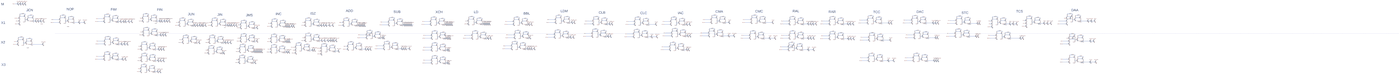
[diagram p0: schematic micro_instructions.asc, whole sheet]
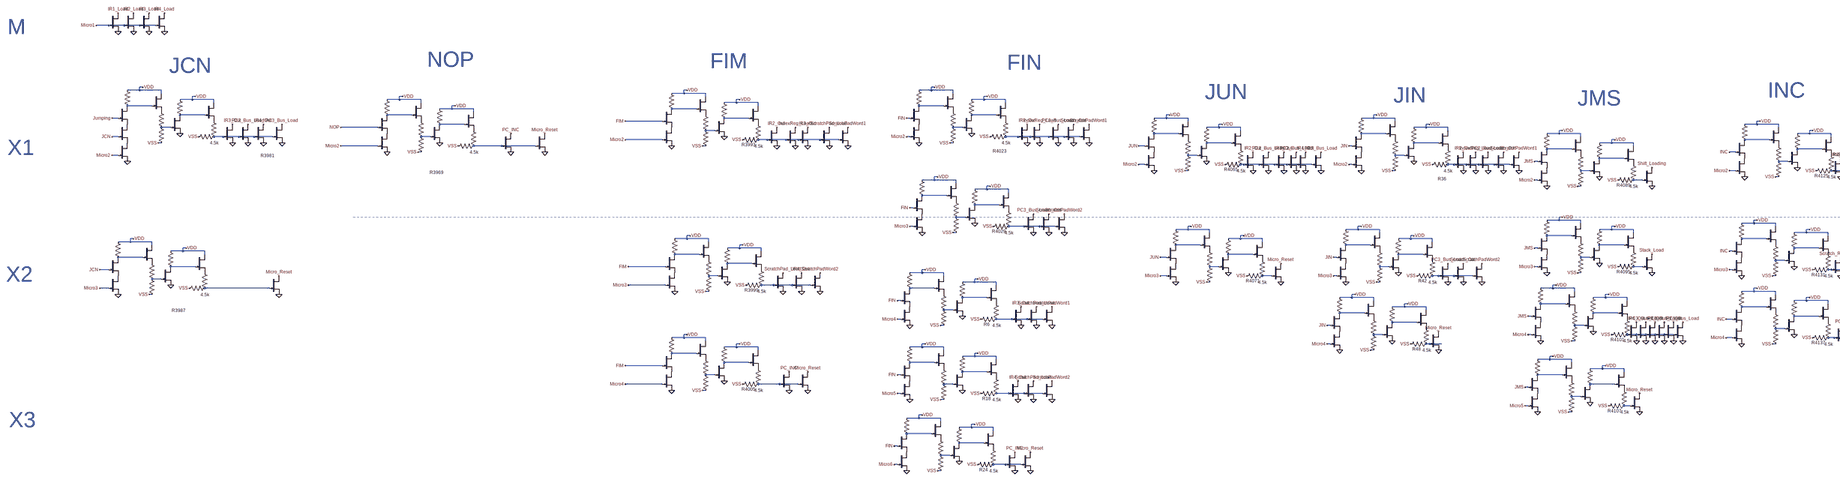
[diagram p1: schematic micro_instructions.asc, part, row 1 of 1, column 1 of 5]
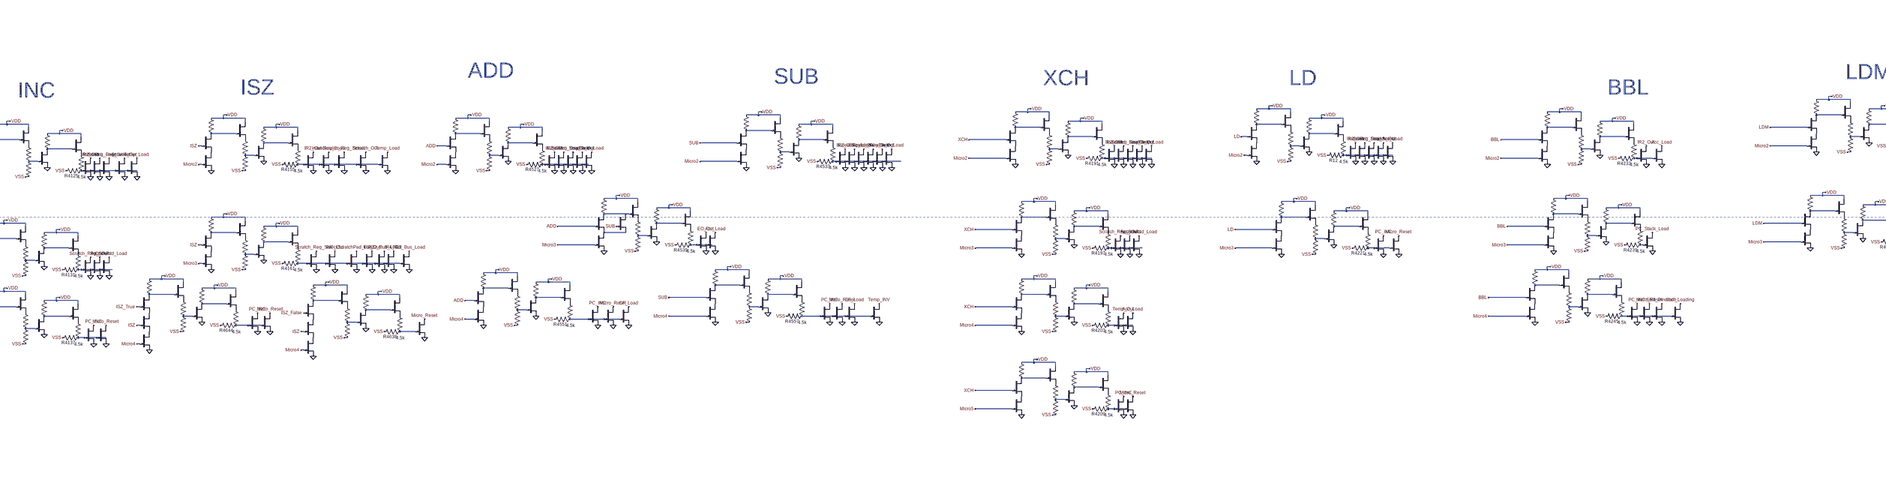
[diagram p2: schematic micro_instructions.asc, part, row 1 of 1, column 2 of 5]
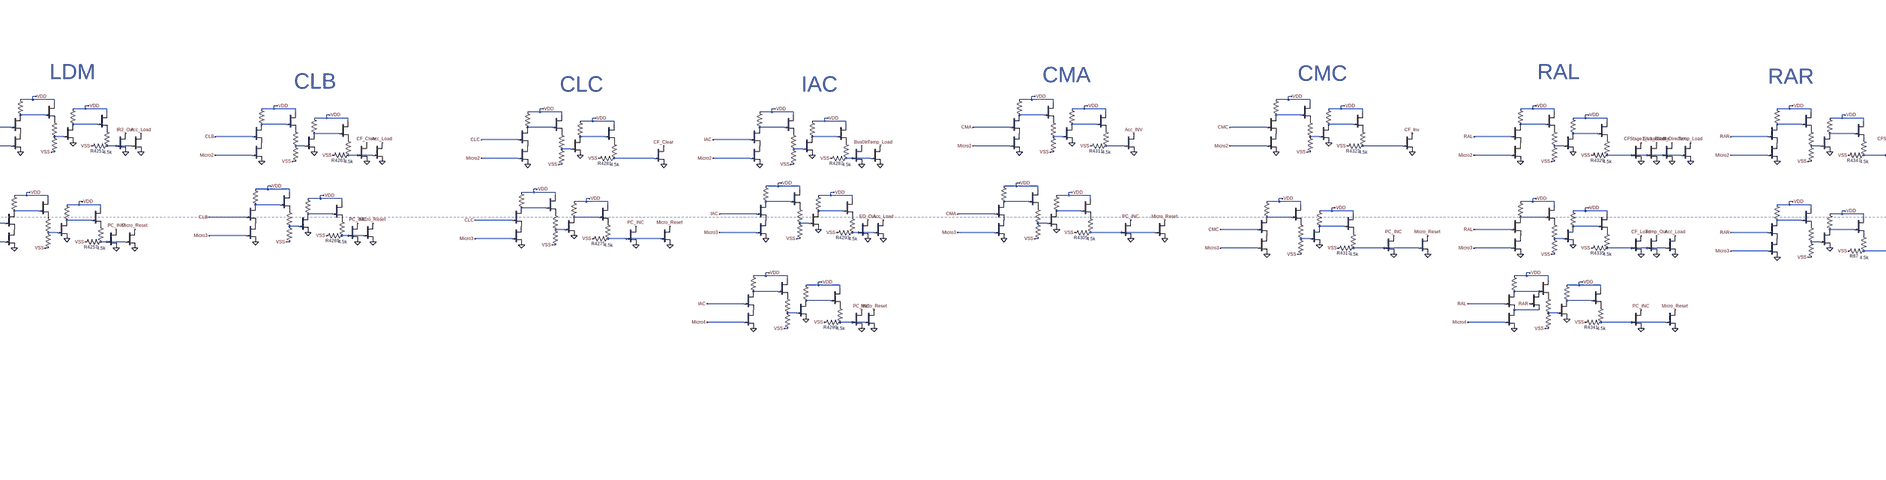
[diagram p3: schematic micro_instructions.asc, part, row 1 of 1, column 3 of 5]
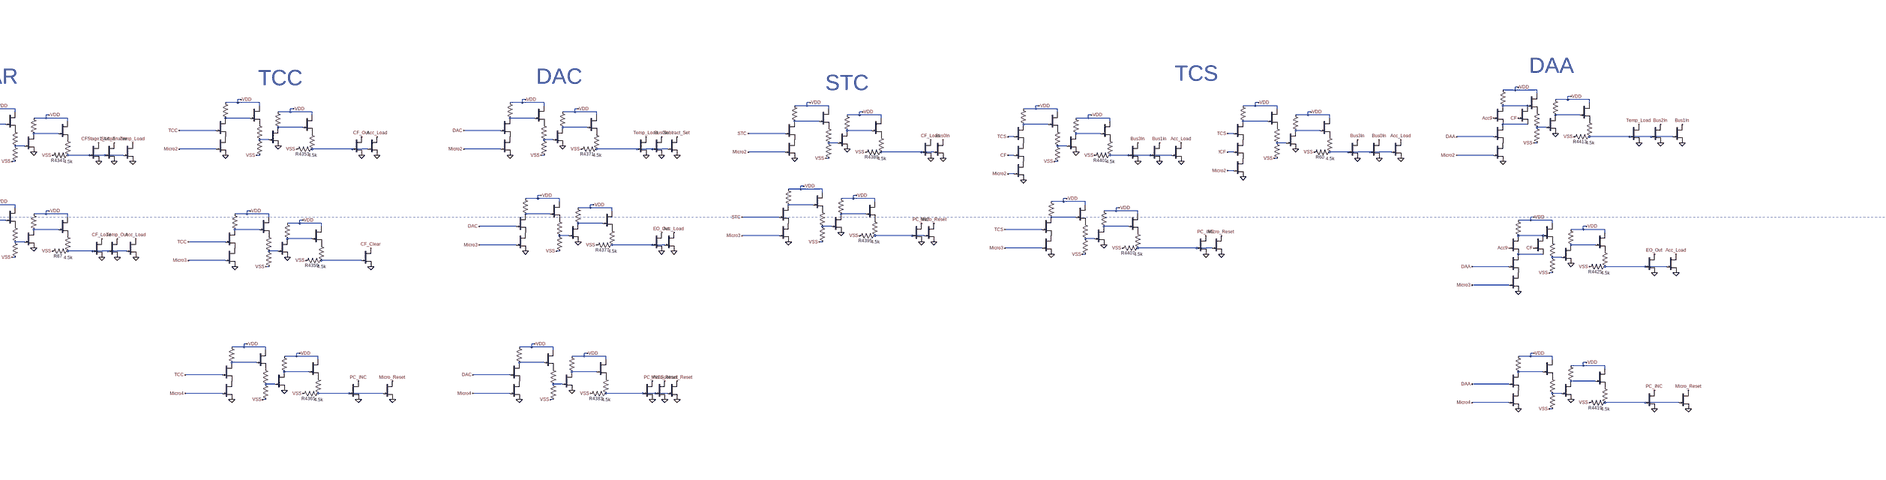
[diagram p4: schematic micro_instructions.asc, part, row 1 of 1, column 4 of 5]
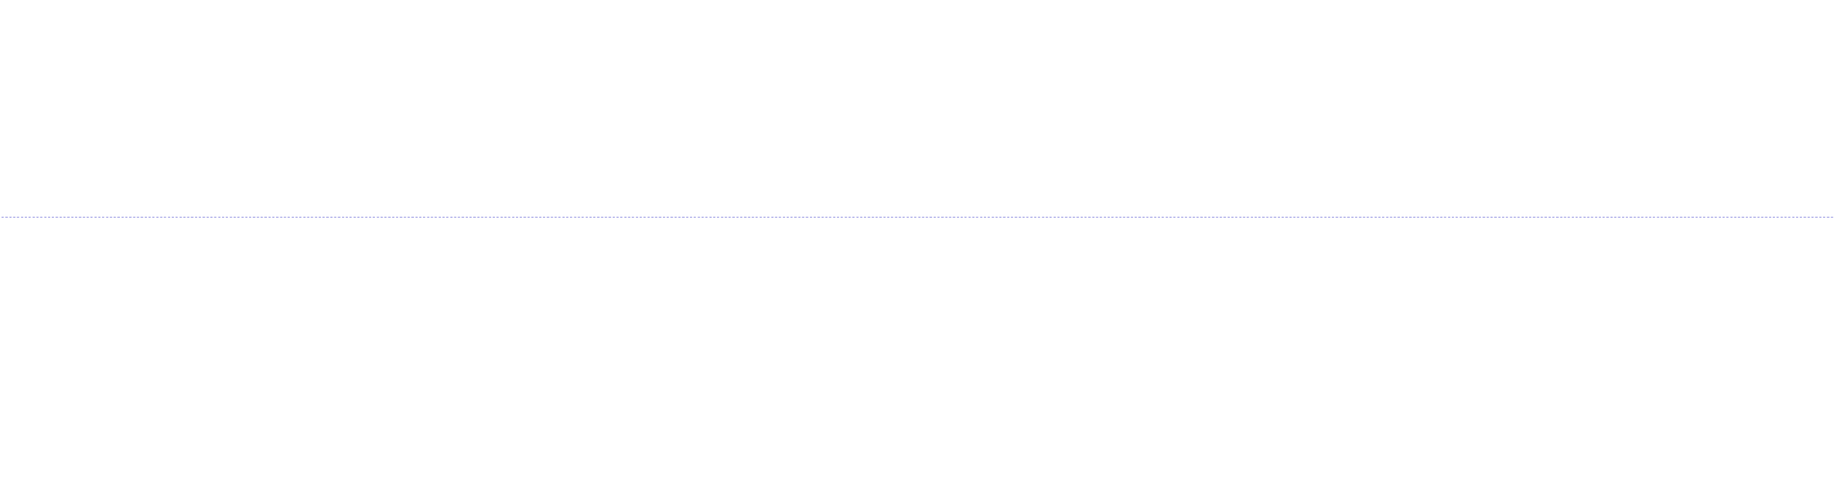
[diagram p5: schematic micro_instructions.asc, part, row 1 of 1, column 5 of 5]
* micro_instructions.asc
J_A2433 N006 NOP P001 DR
R3964 VDD N006 100k
J_F1003 VDD N006 P002 DR
R3965 P002 N050 1k
R3966 N050 VSS 4.8k
J_B1138 P001 Micro2 0 DR
J_A2434 N017 N050 0 DR
R3967 VDD N017 50k
J_F1004 VDD N017 P003 DR
R3968 P003 N071 1k
R3969 N071 VSS 4.5k
J_Input29 PC_INC N071 0 DR
J_Input30 Micro_Reset N071 0 DR
J_Input31 IR3_Out N049 0 DR
J_Input32 PC2_Bus_Load N049 0 DR
J_A2437 P004 JCN P005 DR
R3976 VDD N001 100k
J_F1007 VDD N001 P006 DR
R3977 P006 N027 1k
R3978 N027 VSS 4.8k
J_B1140 P005 Micro2 0 DR
J_A2438 N005 N027 0 DR
R3979 VDD N005 50k
J_F1008 VDD N005 P007 DR
R3980 P007 N049 1k
R3981 N049 VSS 4.5k
J_Input33 IR4_Out N049 0 DR
J_Input34 PC3_Bus_Load N049 0 DR
J_A2439 N197 JCN P008 DR
R3982 VDD N197 100k
J_F1009 VDD N197 P009 DR
R3983 P009 N213 1k
R3984 N213 VSS 4.8k
J_B1141 P008 Micro3 0 DR
J_A2440 N204 N213 0 DR
R3985 VDD N204 50k
J_F1010 VDD N204 P010 DR
R3986 P010 N217 1k
R3987 N217 VSS 4.5k
J_Input35 Micro_Reset N217 0 DR
J_A2441 N001 Jumping P004 DR
J_A2443 N004 FIM P011 DR
R3988 VDD N004 100k
J_F1011 VDD N004 P012 DR
R3989 P012 N036 1k
R3990 N036 VSS 4.8k
J_B1142 P011 Micro2 0 DR
J_A2444 N012 N036 0 DR
R3991 VDD N012 50k
J_F1012 VDD N012 P013 DR
R3992 P013 N060 1k
R3993 N060 VSS 4.5k
J_Input36 IR2_Out N060 0 DR
J_Input38 IndexReg_Load N060 0 DR
J_A2445 N192 FIM P014 DR
R3994 VDD N192 100k
J_F1013 VDD N192 P015 DR
R3995 P015 N210 1k
R3996 N210 VSS 4.8k
J_B1143 P014 Micro3 0 DR
J_A2446 N202 N210 0 DR
R3997 VDD N202 50k
J_F1014 VDD N202 P016 DR
R3998 P016 N214 1k
R3999 N214 VSS 4.5k
J_Input39 IR3_Out N060 0 DR
J_Input40 ScratchPad_Load N060 0 DR
J_A2447 N265 FIM P017 DR
R4000 VDD N265 100k
J_F1015 VDD N265 P018 DR
R4001 P018 N274 1k
R4002 N274 VSS 4.8k
J_B1144 P017 Micro4 0 DR
J_A2448 N266 N274 0 DR
R4003 VDD N266 50k
J_F1016 VDD N266 P019 DR
R4004 P019 N278 1k
R4005 N278 VSS 4.5k
J_Input41 IR4_Out N214 0 DR
J_Input43 ScratchPad_Load N214 0 DR
J_Input46 PC_INC N278 0 DR
J_Input47 Micro_Reset N278 0 DR
J_Input49 IndexReg_Load N051 0 DR
J_A2453 N002 FIN P020 DR
R4018 VDD N002 100k
J_F1021 VDD N002 P021 DR
R4019 P021 N028 1k
R4020 N028 VSS 4.8k
J_B1147 P020 Micro2 0 DR
J_A2454 N007 N028 0 DR
R4021 VDD N007 50k
J_F1022 VDD N007 P022 DR
R4022 P022 N051 1k
R4023 N051 VSS 4.5k
J_Input50 IR2_Out N051 0 DR
J_A2455 N114 FIN P023 DR
R4024 VDD N114 100k
J_F1023 VDD N114 P024 DR
R4025 P024 N129 1k
R4026 N129 VSS 4.8k
J_B1148 P023 Micro3 0 DR
J_A2456 N117 N129 0 DR
R4027 VDD N117 50k
J_F1024 VDD N117 P025 DR
R4028 P025 N143 1k
R4029 N143 VSS 4.5k
J_Input51 PC2_Bus_Load N051 0 DR
J_Input53 Scratch_Out N051 0 DR
J_Input59 PC_INC N296 0 DR
J_Input60 Micro_Reset N296 0 DR
J_A2467 N040 JUN P026 DR
R4060 VDD N040 100k
J_F1035 VDD N040 P027 DR
R4061 P027 N091 1k
R4062 N091 VSS 4.8k
J_B1154 P026 Micro2 0 DR
J_A2468 N065 N091 0 DR
R4063 VDD N065 50k
J_F1036 VDD N065 P028 DR
R4064 P028 N107 1k
R4065 N107 VSS 4.5k
J_Input71 IR2_Out N107 0 DR
J_Input72 PC1_Bus_Load N107 0 DR
J_A2469 N177 JUN P029 DR
R4066 VDD N177 100k
J_F1037 VDD N177 P030 DR
R4067 P030 N205 1k
R4068 N205 VSS 4.8k
J_B1155 P029 Micro3 0 DR
J_A2470 N193 N205 0 DR
R4069 VDD N193 50k
J_F1038 VDD N193 P031 DR
R4070 P031 N211 1k
R4071 N211 VSS 4.5k
J_Input73 IR3_Out N107 0 DR
J_Input74 PC2_Bus_Load N107 0 DR
J_Input75 IR4_Out N107 0 DR
J_Input76 PC3_Bus_Load N107 0 DR
J_Input78 Micro_Reset N211 0 DR
J_A2475 N080 JMS P032 DR
R4084 VDD N080 100k
J_F1043 VDD N080 P033 DR
R4085 P033 N111 1k
R4086 N111 VSS 4.8k
J_B1158 P032 Micro2 0 DR
J_A2476 N100 N111 0 DR
R4087 VDD N100 50k
J_F1044 VDD N100 P034 DR
R4088 P034 N113 1k
R4089 N113 VSS 4.5k
J_Input94 Shift_Loading N113 0 DR
J_A2477 N159 JMS P035 DR
R4090 VDD N159 100k
J_F1045 VDD N159 P036 DR
R4091 P036 N198 1k
R4092 N198 VSS 4.8k
J_B1159 P035 Micro3 0 DR
J_A2478 N179 N198 0 DR
R4093 VDD N179 50k
J_F1046 VDD N179 P037 DR
R4094 P037 N207 1k
R4095 N207 VSS 4.5k
J_Input95 Stack_Load N207 0 DR
J_A2479 N231 JMS P038 DR
R4096 VDD N231 100k
J_F1047 VDD N231 P039 DR
R4097 P039 N256 1k
R4098 N256 VSS 4.8k
J_B1160 P038 Micro4 0 DR
J_A2480 N242 N256 0 DR
R4099 VDD N242 50k
J_F1048 VDD N242 P040 DR
R4100 P040 N262 1k
R4101 N262 VSS 4.5k
J_Input96 IR2_Out N262 0 DR
J_Input97 PC1_Bus_Load N262 0 DR
J_A2481 N275 JMS P041 DR
R4102 VDD N275 100k
J_F1049 VDD N275 P042 DR
R4103 P042 N288 1k
R4104 N288 VSS 4.8k
J_B1161 P041 Micro5 0 DR
J_A2482 N280 N288 0 DR
R4105 VDD N280 50k
J_F1050 VDD N280 P043 DR
R4106 P043 N291 1k
R4107 N291 VSS 4.5k
J_Input98 IR3_Out N262 0 DR
J_Input99 PC2_Bus_Load N262 0 DR
J_Input100 IR4_Out N262 0 DR
J_Input101 PC3_Bus_Load N262 0 DR
J_Input103 Micro_Reset N291 0 DR
J_A2487 N061 INC P044 DR
R4120 VDD N061 100k
J_F1055 VDD N061 P045 DR
R4121 P045 N105 1k
R4122 N105 VSS 4.8k
J_B1164 P044 Micro2 0 DR
J_A2488 N081 N105 0 DR
R4123 VDD N081 50k
J_F1056 VDD N081 P046 DR
R4124 P046 N112 1k
R4125 N112 VSS 4.5k
J_Input104 IR2_Out N112 0 DR
J_Input105 IndexReg_Load N112 0 DR
J_A2489 N166 INC P047 DR
R4126 VDD N166 100k
J_F1057 VDD N166 P048 DR
R4127 P048 N200 1k
R4128 N200 VSS 4.8k
J_B1165 P047 Micro3 0 DR
J_A2490 N184 N200 0 DR
R4129 VDD N184 50k
J_F1058 VDD N184 P049 DR
R4130 P049 N209 1k
R4131 N209 VSS 4.5k
J_Input106 Scratch_Out N112 0 DR
J_Input107 ScratchPad_Load N209 0 DR
J_A2491 N234 INC P050 DR
R4132 VDD N234 100k
J_F1059 VDD N234 P051 DR
R4133 P051 N259 1k
R4134 N259 VSS 4.8k
J_B1166 P050 Micro4 0 DR
J_A2492 N245 N259 0 DR
R4135 VDD N245 50k
J_F1060 VDD N245 P052 DR
R4136 P052 N263 1k
R4137 N263 VSS 4.5k
J_Input108 INC_Out N209 0 DR
J_Input109 Temp_Load N112 0 DR
J_Input112 PC_INC N263 0 DR
J_Input113 Micro_Reset N263 0 DR
J_A2497 N042 ISZ P053 DR
R4150 VDD N042 100k
J_F1065 VDD N042 P054 DR
R4151 P054 N093 1k
R4152 N093 VSS 4.8k
J_B1169 P053 Micro2 0 DR
J_A2498 N067 N093 0 DR
R4153 VDD N067 50k
J_F1066 VDD N067 P055 DR
R4154 P055 N109 1k
R4155 N109 VSS 4.5k
J_Input114 IR2_Out N109 0 DR
J_Input115 IndexReg_Load N109 0 DR
J_A2499 N154 ISZ P056 DR
R4156 VDD N154 100k
J_F1067 VDD N154 P057 DR
R4157 P057 N195 1k
R4158 N195 VSS 4.8k
J_B1170 P056 Micro3 0 DR
J_A2500 N174 N195 0 DR
R4159 VDD N174 50k
J_F1068 VDD N174 P058 DR
R4160 P058 N203 1k
R4161 N203 VSS 4.5k
J_Input116 Scratch_Out N109 0 DR
J_Input119 Temp_Load N109 0 DR
J_Input122 PC_INC N257 0 DR
J_Input123 Micro_Reset N257 0 DR
J_Input124 PC2_Bus_Load N203 0 DR
J_Input125 IR3_Out N203 0 DR
J_Input126 IR4_Out N203 0 DR
J_Input127 PC3_Bus_Load N203 0 DR
J_A2511 N029 XCH P059 DR
R4186 VDD N029 100k
J_F1077 VDD N029 P060 DR
R4187 P060 N082 1k
R4188 N082 VSS 4.8k
J_B1175 P059 Micro2 0 DR
J_A2512 N052 N082 0 DR
R4189 VDD N052 50k
J_F1078 VDD N052 P061 DR
R4190 P061 N101 1k
R4191 N101 VSS 4.5k
J_Input128 IR2_Out N101 0 DR
J_Input129 IndexReg_Load N101 0 DR
J_A2513 N130 XCH P062 DR
R4192 VDD N130 100k
J_F1079 VDD N130 P063 DR
R4193 P063 N167 1k
R4194 N167 VSS 4.8k
J_B1176 P062 Micro3 0 DR
J_A2514 N144 N167 0 DR
R4195 VDD N144 50k
J_F1080 VDD N144 P064 DR
R4196 P064 N185 1k
R4197 N185 VSS 4.5k
J_Input130 Scratch_Out N101 0 DR
J_Input131 Temp_Load N101 0 DR
J_A2515 N224 XCH P065 DR
R4198 VDD N224 100k
J_F1081 VDD N224 P066 DR
R4199 P066 N248 1k
R4200 N248 VSS 4.8k
J_B1177 P065 Micro4 0 DR
J_A2516 N233 N248 0 DR
R4201 VDD N233 50k
J_F1082 VDD N233 P067 DR
R4202 P067 N258 1k
R4203 N258 VSS 4.5k
J_Input132 Acc_Out N185 0 DR
J_Input133 ScratchPad_Load N185 0 DR
J_A2517 N276 XCH P068 DR
R4204 VDD N276 100k
J_F1083 VDD N276 P069 DR
R4205 P069 N289 1k
R4206 N289 VSS 4.8k
J_B1178 P068 Micro5 0 DR
J_A2518 N283 N289 0 DR
R4207 VDD N283 50k
J_F1084 VDD N283 P070 DR
R4208 P070 N292 1k
R4209 N292 VSS 4.5k
J_Input134 Temp_Out N258 0 DR
J_Input135 Acc_Load N258 0 DR
J_Input136 PC_INC N292 0 DR
J_Input137 Micro_Reset N292 0 DR
J_A2521 N131 LD P071 DR
R4216 VDD N131 100k
J_F1087 VDD N131 P072 DR
R4217 P072 N168 1k
R4218 N168 VSS 4.8k
J_B1180 P071 Micro3 0 DR
J_A2522 N145 N168 0 DR
R4219 VDD N145 50k
J_F1088 VDD N145 P073 DR
R4220 P073 N186 1k
R4221 N186 VSS 4.5k
J_Input138 Scratch_Out N095 0 DR
J_Input139 Acc_Load N095 0 DR
J_Input140 PC_INC N186 0 DR
J_Input141 Micro_Reset N186 0 DR
J_A2526 N030 BBL P074 DR
R4228 VDD N030 100k
J_F1091 VDD N030 P075 DR
R4229 P075 N083 1k
R4230 N083 VSS 4.8k
J_B1182 P074 Micro2 0 DR
J_A2527 N053 N083 0 DR
R4231 VDD N053 50k
J_F1092 VDD N053 P076 DR
R4232 P076 N102 1k
R4233 N102 VSS 4.5k
J_Input142 IR2_Out N102 0 DR
J_Input143 Acc_Load N102 0 DR
J_Input144 Shift_Direction N249 0 DR
J_Input145 Shift_Loading N249 0 DR
J_A2528 N125 BBL P077 DR
R4234 VDD N125 100k
J_F1093 VDD N125 P078 DR
R4235 P078 N161 1k
R4236 N161 VSS 4.8k
J_B1183 P077 Micro3 0 DR
J_A2529 N139 N161 0 DR
R4237 VDD N139 50k
J_F1094 VDD N139 P079 DR
R4238 P079 N181 1k
R4239 N181 VSS 4.5k
J_Input146 PC_Stack_Load N181 0 DR
J_A2530 N216 BBL P080 DR
R4240 VDD N216 100k
J_F1095 VDD N216 P081 DR
R4241 P081 N236 1k
R4242 N236 VSS 4.8k
J_B1184 P080 Micro4 0 DR
J_A2531 N225 N236 0 DR
R4243 VDD N225 50k
J_F1096 VDD N225 P082 DR
R4244 P082 N249 1k
R4245 N249 VSS 4.5k
J_Input147 PC_INC N249 0 DR
J_Input148 Micro_Reset N249 0 DR
J_A2532 N008 LDM P083 DR
R4246 VDD N008 100k
J_F1097 VDD N008 P084 DR
R4247 P084 N054 1k
R4248 N054 VSS 4.8k
J_B1185 P083 Micro2 0 DR
J_A2533 N019 N054 0 DR
R4249 VDD N019 50k
J_F1098 VDD N019 P085 DR
R4250 P085 N073 1k
R4251 N073 VSS 4.5k
J_Input149 IR2_Out N073 0 DR
J_Input150 Acc_Load N073 0 DR
J_A2534 N121 LDM P086 DR
R4252 VDD N121 100k
J_F1099 VDD N121 P087 DR
R4253 P087 N156 1k
R4254 N156 VSS 4.8k
J_B1186 P086 Micro3 0 DR
J_A2535 N136 N156 0 DR
R4255 VDD N136 50k
J_F1100 VDD N136 P088 DR
R4256 P088 N175 1k
R4257 N175 VSS 4.5k
J_Input151 PC_INC N175 0 DR
J_Input152 Micro_Reset N175 0 DR
J_Input153 Acc_Load N096 0 DR
J_A2536 N020 CLB P089 DR
R4258 VDD N020 100k
J_F1101 VDD N020 P090 DR
R4259 P090 N074 1k
R4260 N074 VSS 4.8k
J_B1187 P089 Micro2 0 DR
J_A2537 N045 N074 0 DR
R4261 VDD N045 50k
J_F1102 VDD N045 P091 DR
R4262 P091 N096 1k
R4263 N096 VSS 4.5k
J_Input154 CF_Clear N096 0 DR
J_A2538 N118 CLB P092 DR
R4264 VDD N118 100k
J_F1103 VDD N118 P093 DR
R4265 P093 N146 1k
R4266 N146 VSS 4.8k
J_B1188 P092 Micro3 0 DR
J_A2539 N126 N146 0 DR
R4267 VDD N126 50k
J_F1104 VDD N126 P094 DR
R4268 P094 N162 1k
R4269 N162 VSS 4.5k
J_Input155 PC_INC N162 0 DR
J_Input156 Micro_Reset N162 0 DR
J_A2540 N120 CLC P095 DR
R4270 VDD N120 100k
J_F1105 VDD N120 P096 DR
R4271 P096 N151 1k
R4272 N151 VSS 4.8k
J_B1189 P095 Micro3 0 DR
J_A2541 N132 N151 0 DR
R4273 VDD N132 50k
J_F1106 VDD N132 P097 DR
R4274 P097 N169 1k
R4275 N169 VSS 4.5k
J_Input157 PC_INC N169 0 DR
J_Input158 Micro_Reset N169 0 DR
J_A2542 N031 CLC P098 DR
R4276 VDD N031 100k
J_F1107 VDD N031 P099 DR
R4277 P099 N084 1k
R4278 N084 VSS 4.8k
J_B1190 P098 Micro2 0 DR
J_A2543 N055 N084 0 DR
R4279 VDD N055 50k
J_F1108 VDD N055 P100 DR
R4280 P100 N103 1k
R4281 N103 VSS 4.5k
J_Input159 CF_Clear N103 0 DR
J_Input160 Temp_Load N104 0 DR
J_A2544 N032 IAC P101 DR
R4282 VDD N032 100k
J_F1109 VDD N032 P102 DR
R4283 P102 N085 1k
R4284 N085 VSS 4.8k
J_B1191 P101 Micro2 0 DR
J_A2545 N056 N085 0 DR
R4285 VDD N056 50k
J_F1110 VDD N056 P103 DR
R4286 P103 N104 1k
R4287 N104 VSS 4.5k
J_Input161 Bus0In N104 0 DR
J_A2546 N115 IAC P104 DR
R4288 VDD N115 100k
J_F1111 VDD N115 P105 DR
R4289 P105 N140 1k
R4290 N140 VSS 4.8k
J_B1192 P104 Micro3 0 DR
J_A2547 N122 N140 0 DR
R4291 VDD N122 50k
J_F1112 VDD N122 P106 DR
R4292 P106 N157 1k
R4293 N157 VSS 4.5k
J_Input162 EO_Out N157 0 DR
J_Input163 Acc_Load N157 0 DR
J_A2548 N220 IAC P107 DR
R4294 VDD N220 100k
J_F1113 VDD N220 P108 DR
R4295 P108 N243 1k
R4296 N243 VSS 4.8k
J_B1193 P107 Micro4 0 DR
J_A2549 N229 N243 0 DR
R4297 VDD N229 50k
J_F1114 VDD N229 P109 DR
R4298 P109 N254 1k
R4299 N254 VSS 4.5k
J_Input164 PC_INC N254 0 DR
J_Input165 Micro_Reset N254 0 DR
J_A2550 N116 CMA P110 DR
R4300 VDD N116 100k
J_F1115 VDD N116 P111 DR
R4301 P111 N141 1k
R4302 N141 VSS 4.8k
J_B1194 P110 Micro3 0 DR
J_A2551 N123 N141 0 DR
R4303 VDD N123 50k
J_F1116 VDD N123 P112 DR
R4304 P112 N158 1k
R4305 N158 VSS 4.5k
J_Input166 PC_INC N158 0 DR
J_Input167 Micro_Reset N158 0 DR
J_A2552 N009 CMA P113 DR
R4306 VDD N009 100k
J_F1117 VDD N009 P114 DR
R4307 P114 N057 1k
R4308 N057 VSS 4.8k
J_B1195 P113 Micro2 0 DR
J_A2553 N021 N057 0 DR
R4309 VDD N021 50k
J_F1118 VDD N021 P115 DR
R4310 P115 N075 1k
R4311 N075 VSS 4.5k
J_Input168 Acc_INV N075 0 DR
J_A2554 N133 CMC P116 DR
R4312 VDD N133 100k
J_F1119 VDD N133 P117 DR
R4313 P117 N170 1k
R4314 N170 VSS 4.8k
J_B1196 P116 Micro3 0 DR
J_A2555 N147 N170 0 DR
R4315 VDD N147 50k
J_F1120 VDD N147 P118 DR
R4316 P118 N187 1k
R4317 N187 VSS 4.5k
J_Input169 PC_INC N187 0 DR
J_Input170 Micro_Reset N187 0 DR
J_A2556 N010 CMC P119 DR
R4318 VDD N010 100k
J_F1121 VDD N010 P120 DR
R4319 P120 N058 1k
R4320 N058 VSS 4.8k
J_B1197 P119 Micro2 0 DR
J_A2557 N022 N058 0 DR
R4321 VDD N022 50k
J_F1122 VDD N022 P121 DR
R4322 P121 N076 1k
R4323 N076 VSS 4.5k
J_Input171 CF_Inv N076 0 DR
J_A2558 N023 RAL P122 DR
R4324 VDD N023 100k
J_F1123 VDD N023 P123 DR
R4325 P123 N077 1k
R4326 N077 VSS 4.8k
J_B1198 P122 Micro2 0 DR
J_A2559 N046 N077 0 DR
R4327 VDD N046 50k
J_F1124 VDD N046 P124 DR
R4328 P124 N097 1k
R4329 N097 VSS 4.5k
J_Input172 Shift_Enable N097 0 DR
J_Input173 Temp_Load N097 0 DR
J_Input174 Shift_Direction N097 0 DR
J_A2560 N134 RAL P125 DR
R4330 VDD N134 100k
J_F1125 VDD N134 P126 DR
R4331 P126 N171 1k
R4332 N171 VSS 4.8k
J_B1199 P125 Micro3 0 DR
J_A2561 N148 N171 0 DR
R4333 VDD N148 50k
J_F1126 VDD N148 P127 DR
R4334 P127 N188 1k
R4335 N188 VSS 4.5k
J_Input175 Temp_Out N188 0 DR
J_Input176 Acc_Load N188 0 DR
J_A2562 N221 RAL N240 DR
R4336 VDD N221 100k
J_F1127 VDD N221 P128 DR
R4337 P128 N244 1k
R4338 N244 VSS 4.8k
J_B1200 N240 Micro4 0 DR
J_A2563 N230 N244 0 DR
R4339 VDD N230 50k
J_F1128 VDD N230 P129 DR
R4340 P129 N255 1k
R4341 N255 VSS 4.5k
J_Input177 PC_INC N255 0 DR
J_Input178 Micro_Reset N255 0 DR
J_A2564 N024 RAR P130 DR
R4342 VDD N024 100k
J_F1129 VDD N024 P131 DR
R4343 P131 N078 1k
R4344 N078 VSS 4.8k
J_B1201 P130 Micro2 0 DR
J_A2565 N047 N078 0 DR
R4345 VDD N047 50k
J_F1130 VDD N047 P132 DR
R4346 P132 N098 1k
R4347 N098 VSS 4.5k
J_A2567 N221 RAR N240 DR
J_A2568 N013 TCC P133 DR
R4348 VDD N013 100k
J_F1131 VDD N013 P134 DR
R4349 P134 N063 1k
R4350 N063 VSS 4.8k
J_B1202 P133 Micro2 0 DR
J_A2569 N033 N063 0 DR
R4351 VDD N033 50k
J_F1132 VDD N033 P135 DR
R4352 P135 N086 1k
R4353 N086 VSS 4.5k
J_Input181 CF_Out N086 0 DR
J_Input182 Acc_Load N086 0 DR
J_A2570 N153 TCC P136 DR
R4354 VDD N153 100k
J_F1133 VDD N153 P137 DR
R4355 P137 N191 1k
R4356 N191 VSS 4.8k
J_B1203 P136 Micro3 0 DR
J_A2571 N172 N191 0 DR
R4357 VDD N172 50k
J_F1134 VDD N172 P138 DR
R4358 P138 N201 1k
R4359 N201 VSS 4.5k
J_Input183 CF_Clear N201 0 DR
J_A2572 N268 TCC P139 DR
R4360 VDD N268 100k
J_F1135 VDD N268 P140 DR
R4361 P140 N281 1k
R4362 N281 VSS 4.8k
J_B1204 P139 Micro4 0 DR
J_A2573 N271 N281 0 DR
R4363 VDD N271 50k
J_F1136 VDD N271 P141 DR
R4364 P141 N285 1k
R4365 N285 VSS 4.5k
J_Input184 PC_INC N285 0 DR
J_Input185 Micro_Reset N285 0 DR
J_A2574 N014 DAC P142 DR
R4366 VDD N014 100k
J_F1137 VDD N014 P143 DR
R4367 P143 N064 1k
R4368 N064 VSS 4.8k
J_B1205 P142 Micro2 0 DR
J_A2575 N034 N064 0 DR
R4369 VDD N034 50k
J_F1138 VDD N034 P144 DR
R4370 P144 N087 1k
R4371 N087 VSS 4.5k
J_Input186 Bus0In N087 0 DR
J_Input187 Temp_Load N087 0 DR
J_Input188 Subtract_Set N087 0 DR
J_A2576 N127 DAC P145 DR
R4372 VDD N127 100k
J_F1139 VDD N127 P146 DR
R4373 P146 N163 1k
R4374 N163 VSS 4.8k
J_B1206 P145 Micro3 0 DR
J_A2577 N142 N163 0 DR
R4375 VDD N142 50k
J_F1140 VDD N142 P147 DR
R4376 P147 N182 1k
R4377 N182 VSS 4.5k
J_Input189 EO_Out N182 0 DR
J_Input190 Subtract_Reset N286 0 DR
J_Input191 Acc_Load N182 0 DR
J_A2578 N269 DAC P148 DR
R4378 VDD N269 100k
J_F1141 VDD N269 P149 DR
R4379 P149 N282 1k
R4380 N282 VSS 4.8k
J_B1207 P148 Micro4 0 DR
J_A2579 N272 N282 0 DR
R4381 VDD N272 50k
J_F1142 VDD N272 P150 DR
R4382 P150 N286 1k
R4383 N286 VSS 4.5k
J_Input192 PC_INC N286 0 DR
J_Input193 Micro_Reset N286 0 DR
J_Input194 Bus0In N089 0 DR
J_A2580 N015 STC P151 DR
R4384 VDD N015 100k
J_F1143 VDD N015 P152 DR
R4385 P152 N069 1k
R4386 N069 VSS 4.8k
J_B1208 P151 Micro2 0 DR
J_A2581 N038 N069 0 DR
R4387 VDD N038 50k
J_F1144 VDD N038 P153 DR
R4388 P153 N089 1k
R4389 N089 VSS 4.5k
J_Input195 CF_Load N089 0 DR
J_A2582 N119 STC P154 DR
R4390 VDD N119 100k
J_F1145 VDD N119 P155 DR
R4391 P155 N149 1k
R4392 N149 VSS 4.8k
J_B1209 P154 Micro3 0 DR
J_A2583 N128 N149 0 DR
R4393 VDD N128 50k
J_F1146 VDD N128 P156 DR
R4394 P156 N164 1k
R4395 N164 VSS 4.5k
J_Input196 PC_INC N164 0 DR
J_Input197 Micro_Reset N164 0 DR
J_A2584 N025 TCS P157 DR
R4396 VDD N025 100k
J_F1147 VDD N025 P158 DR
R4397 P158 N079 1k
R4398 N079 VSS 4.8k
J_B1210 P159 Micro2 0 DR
J_A2585 N048 N079 0 DR
R4399 VDD N048 50k
J_F1148 VDD N048 P160 DR
R4400 P160 N099 1k
R4401 N099 VSS 4.5k
J_Input198 Bus3In N099 0 DR
J_A2586 N135 TCS P161 DR
R4402 VDD N135 100k
J_F1149 VDD N135 P162 DR
R4403 P162 N173 1k
R4404 N173 VSS 4.8k
J_B1211 P161 Micro3 0 DR
J_A2587 N150 N173 0 DR
R4405 VDD N150 50k
J_F1150 VDD N150 P163 DR
R4406 P163 N189 1k
R4407 N189 VSS 4.5k
J_Input200 Acc_Load N099 0 DR
J_Input201 PC_INC N189 0 DR
J_Input202 Micro_Reset N189 0 DR
J_A2588 N026 DAA P164 DR
R4408 VDD N003 100k
J_F1151 VDD N003 P165 DR
R4409 P165 N035 1k
R4410 N035 VSS 4.8k
J_B1212 P164 Micro2 0 DR
J_A2589 N011 N035 0 DR
R4411 VDD N011 50k
J_F1152 VDD N011 P166 DR
R4412 P166 N059 1k
R4413 N059 VSS 4.5k
J_Input203 Temp_Load N059 0 DR
J_Input204 Bus2In N059 0 DR
J_A2590 N273 DAA P167 DR
R4414 VDD N273 100k
J_F1153 VDD N273 P168 DR
R4415 P168 N287 1k
R4416 N287 VSS 4.8k
J_B1213 P167 Micro4 0 DR
J_A2591 N277 N287 0 DR
R4417 VDD N277 50k
J_F1154 VDD N277 P169 DR
R4418 P169 N290 1k
R4419 N290 VSS 4.5k
J_Input205 Bus1In N059 0 DR
J_Input206 PC_INC N290 0 DR
J_Input207 Micro_Reset N290 0 DR
J_A2592 N196 DAA P170 DR
R4420 VDD N165 100k
J_F1155 VDD N165 P171 DR
R4421 P171 N199 1k
R4422 N199 VSS 4.8k
J_B1214 P170 Micro3 0 DR
J_A2593 N183 N199 0 DR
R4423 VDD N183 50k
J_F1156 VDD N183 P172 DR
R4424 P172 N208 1k
R4425 N208 VSS 4.5k
J_Input208 EO_Out N208 0 DR
J_Input209 Acc_Load N208 0 DR
J_A2594 N003 Acc9 N026 DR
J_A2595 N003 CF N026 DR
J_A2596 N165 Acc9 N196 DR
J_A2597 N165 CF N196 DR
J_A2631 N043 ADD P173 DR
R4522 VDD N043 100k
J_F1189 VDD N043 P174 DR
R4523 P174 N094 1k
R4524 N094 VSS 4.8k
J_B1231 P173 Micro2 0 DR
J_A2632 N068 N094 0 DR
R4525 VDD N068 50k
J_F1190 VDD N068 P175 DR
R4526 P175 N110 1k
R4527 N110 VSS 4.5k
J_A2633 N037 SUB P176 DR
R4528 VDD N037 100k
J_F1191 VDD N037 P177 DR
R4529 P177 N088 1k
R4530 N088 VSS 4.8k
J_B1232 P176 Micro2 0 DR
J_A2634 N062 N088 0 DR
R4531 VDD N062 50k
J_F1192 VDD N062 P178 DR
R4532 P178 N106 1k
R4533 N106 VSS 4.5k
J_Input248 IR2_Out N110 0 DR
J_Input249 IR2_Out N106 0 DR
J_Input250 IndexReg_Load N110 0 DR
J_Input251 IndexReg_Load N106 0 DR
J_A2635 N124 ADD N155 DR
R4534 VDD N124 100k
J_F1193 VDD N124 P179 DR
R4535 P179 N160 1k
R4536 N160 VSS 4.8k
J_B1233 N155 Micro3 0 DR
J_A2636 N138 N160 0 DR
R4537 VDD N138 50k
J_F1194 VDD N138 P180 DR
R4538 P180 N180 1k
R4539 N180 VSS 4.5k
J_Input252 Scratch_Out N110 0 DR
J_Input253 Temp_Load N110 0 DR
J_Input254 EO_Out N180 0 DR
J_Input255 Acc_Load N180 0 DR
J_A2639 N219 ADD P181 DR
R4546 VDD N219 100k
J_F1197 VDD N219 P182 DR
R4547 P182 N239 1k
R4548 N239 VSS 4.8k
J_B1235 P181 Micro4 0 DR
J_A2640 N227 N239 0 DR
R4549 VDD N227 50k
J_F1198 VDD N227 P183 DR
R4550 P183 N251 1k
R4551 N251 VSS 4.5k
J_Input256 PC_INC N251 0 DR
J_Input257 Micro_Reset N251 0 DR
J_Input258 Temp_INV N106 0 DR
J_A2641 N124 SUB N155 DR
J_Input259 CF_Load N251 0 DR
J_A2644 N215 SUB P184 DR
R4552 VDD N215 100k
J_F1199 VDD N215 P185 DR
R4553 P185 N235 1k
R4554 N235 VSS 4.8k
J_B1236 P184 Micro4 0 DR
J_A2645 N223 N235 0 DR
R4555 VDD N223 50k
J_F1200 VDD N223 P186 DR
R4556 P186 N247 1k
R4557 N247 VSS 4.5k
J_Input261 PC_INC N247 0 DR
J_Input262 Micro_Reset N247 0 DR
J_Input263 CF_Load N247 0 DR
J_Input265 Temp_INV N247 0 DR
J_A2672 N228 ISZ_False P187 DR
R4633 VDD N228 100k
J_F1224 VDD N228 P188 DR
R4634 P188 N253 1k
R4635 N253 VSS 4.8k
J_B1250 P187 ISZ P189 DR
J_A2673 N238 N253 0 DR
R4636 VDD N238 50k
J_F1225 VDD N238 P190 DR
R4637 P190 N260 1k
R4638 N260 VSS 4.5k
J_A2674 P189 Micro4 0 DR
J_A2675 N222 ISZ_True P191 DR
R4639 VDD N222 100k
J_F1226 VDD N222 P192 DR
R4640 P192 N246 1k
R4641 N246 VSS 4.8k
J_B1251 P191 ISZ P193 DR
J_A2676 N232 N246 0 DR
R4642 VDD N232 50k
J_F1227 VDD N232 P194 DR
R4643 P194 N257 1k
R4644 N257 VSS 4.5k
J_A2677 P193 Micro4 0 DR
J_Input77 Micro_Reset N260 0 DR
J_Input2 IR1_Load Micro1 0 DR
J_Input3 IR2_Load Micro1 0 DR
J_A1 N218 FIN P195 DR
R1 VDD N218 100k
J_F1 VDD N218 P196 DR
R2 P196 N237 1k
R3 N237 VSS 4.8k
J_B6 P195 Micro4 0 DR
J_A2 N226 N237 0 DR
R4 VDD N226 50k
J_F2 VDD N226 P197 DR
R5 P197 N250 1k
R6 N250 VSS 4.5k
J_Input26 PC3_Bus_Load N143 0 DR
J_Input52 Scratch_Out N143 0 DR
J_Input62 ScratchPadWord1 N051 0 DR
J_Input68 ScratchPad_Load N250 0 DR
J_A5 N267 FIN P198 DR
R13 VDD N267 100k
J_F5 VDD N267 P199 DR
R14 P199 N279 1k
R15 N279 VSS 4.8k
J_B10 P198 Micro5 0 DR
J_A6 N270 N279 0 DR
R16 VDD N270 50k
J_F6 VDD N270 P200 DR
R17 P200 N284 1k
R18 N284 VSS 4.5k
J_Input270 IR3_Out N250 0 DR
J_Input268 ScratchPad_Load N284 0 DR
J_A7 N293 FIN P201 DR
R19 VDD N293 100k
J_F7 VDD N293 P202 DR
R20 P202 N295 1k
R21 N295 VSS 4.8k
J_B12 P201 Micro6 0 DR
J_A8 N294 N295 0 DR
R22 VDD N294 50k
J_F8 VDD N294 P203 DR
R23 P203 N296 1k
R24 N296 VSS 4.5k
J_Input272 IR4_Out N284 0 DR
J_Input55 IndexReg_Load N108 0 DR
J_A11 N041 JIN P204 DR
R31 VDD N041 100k
J_F11 VDD N041 P205 DR
R32 P205 N092 1k
R33 N092 VSS 4.8k
J_B9 P204 Micro2 0 DR
J_A12 N066 N092 0 DR
R34 VDD N066 50k
J_F12 VDD N066 P206 DR
R35 P206 N108 1k
R36 N108 VSS 4.5k
J_Input56 IR2_Out N108 0 DR
J_A13 N178 JIN P207 DR
R37 VDD N178 100k
J_F13 VDD N178 P208 DR
R38 P208 N206 1k
R39 N206 VSS 4.8k
J_B17 P207 Micro3 0 DR
J_A14 N194 N206 0 DR
R40 VDD N194 50k
J_F14 VDD N194 P209 DR
R41 P209 N212 1k
R42 N212 VSS 4.5k
J_Input57 PC2_Bus_Load N108 0 DR
J_Input58 Scratch_Out N108 0 DR
J_A15 N241 JIN P210 DR
R43 VDD N241 100k
J_F15 VDD N241 P211 DR
R44 P211 N261 1k
R45 N261 VSS 4.8k
J_B20 P210 Micro4 0 DR
J_A16 N252 N261 0 DR
R46 VDD N252 50k
J_F16 VDD N252 P212 DR
R47 P212 N264 1k
R48 N264 VSS 4.5k
J_Input66 PC3_Bus_Load N212 0 DR
J_Input69 Scratch_Out N212 0 DR
J_Input273 Micro_Reset N264 0 DR
J_Input37 ScratchPadWord1 N060 0 DR
J_Input14 Scratch_Reg_Select N112 0 DR
J_Input25 Scratch_Reg_Select N109 0 DR
J_Input42 Scratch_Reg_Select N110 0 DR
J_Input48 Scratch_Reg_Select N101 0 DR
J_Input54 Scratch_Reg_Select N185 0 DR
J_Input61 Scratch_Reg_Select N095 0 DR
J_Input44 ScratchPadWord2 N214 0 DR
J_Input45 ScratchPadWord2 N143 0 DR
J_Input80 ScratchPadWord1 N250 0 DR
J_Input81 ScratchPadWord2 N284 0 DR
J_Input82 ScratchPadWord1 N108 0 DR
J_Input83 ScratchPadWord2 N212 0 DR
J_Input65 ScratchPad_Load N203 0 DR
J_Input85 INC_Out N203 0 DR
J_Input86 Scratch_Reg_Select N209 0 DR
J_Input87 Scratch_Reg_Select N203 0 DR
J_Input89 Shift_Enable N098 0 DR
J_Input90 Temp_Load N098 0 DR
J_Input92 CF_Load N188 0 DR
J_A28 N137 RAR P213 DR
R82 VDD N137 100k
J_F26 VDD N137 P214 DR
R83 P214 N176 1k
R84 N176 VSS 4.8k
J_B30 P213 Micro3 0 DR
J_A29 N152 N176 0 DR
R85 VDD N152 50k
J_F27 VDD N152 P215 DR
R86 P215 N190 1k
R87 N190 VSS 4.5k
J_Input91 Temp_Out N190 0 DR
J_Input93 Acc_Load N190 0 DR
J_Input110 CF_Load N190 0 DR
J_Input88 CFStage1_Load N097 0 DR
J_Input111 CFStage1_Load N098 0 DR
J_B33 P157 CF P159 DR
J_Input9 Bus1In N099 0 DR
J_A19 N016 TCS P216 DR
R55 VDD N016 100k
J_F19 VDD N016 P217 DR
R56 P217 N070 1k
R57 N070 VSS 4.8k
J_B34 P218 Micro2 0 DR
J_A20 N039 N070 0 DR
R58 VDD N039 50k
J_F28 VDD N039 P219 DR
R59 P219 N090 1k
R60 N090 VSS 4.5k
J_Input28 Bus3In N090 0 DR
J_Input117 Acc_Load N090 0 DR
J_B35 P216 !CF P218 DR
J_Input118 Bus0In N090 0 DR
J_Input1 IR3_Load Micro1 0 DR
J_Input4 IR4_Load Micro1 0 DR
J_Input5 Scratch_Out N106 0 DR
J_Input6 Temp_Load N106 0 DR
J_Input7 Scratch_Reg_Select N106 0 DR
J_A3 N018 LD P220 DR
R7 VDD N018 100k
J_F3 VDD N018 P221 DR
R8 P221 N072 1k
R9 N072 VSS 4.8k
J_B1 P220 Micro2 0 DR
J_A4 N044 N072 0 DR
R10 VDD N044 50k
J_F4 VDD N044 P222 DR
R11 P222 N095 1k
R12 N095 VSS 4.5k
J_Input8 IR2_Out N095 0 DR
J_Input10 IndexReg_Load N095 0 DR
.model NJF NJF
.model PJF PJF
.lib standard.jft
* M
* X1
* X2
* NOP
* X3
* JCN
* FIM
* FIN
* JUN
* JMS
* INC
* ISZ
* XCH
* LD
* BBL
* LDM
* CLB
* CLC
* IAC
* CMA
* CMC
* RAL
* RAR
* TCC
* DAC
* STC
* TCS
* DAA
* ADD
* SUB
* JIN
.backanno
.end